# Altium schematic sheet EtherWiz_FullSize.SchDoc
size A3; SheetNumber: 3; SheetTotal: 3
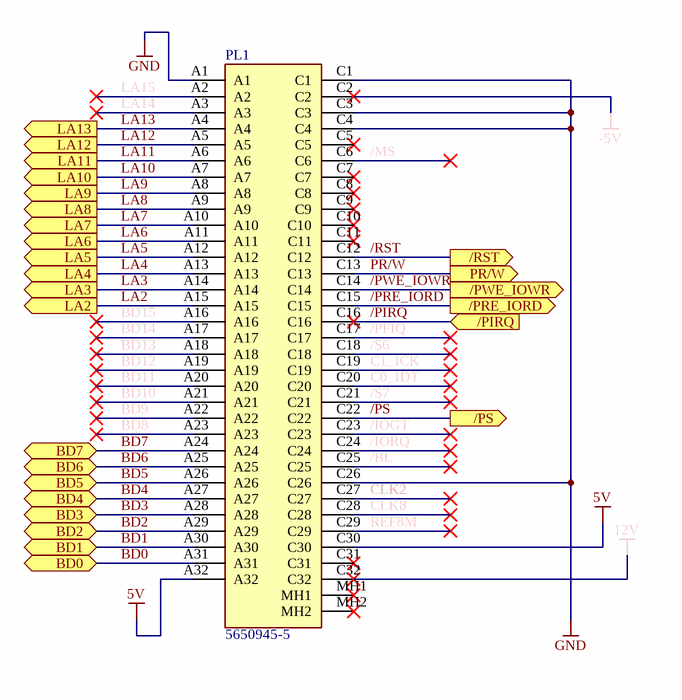
[diagram p0: EtherWiz_FullSize.SchDoc]

## Parts
PL1  5650945-5  [56509455]

## Ports
/PIRQ (in, see EtherWiz[3D]), /PRE_IORD (out, see EtherWiz[6A]), /PS (out, see EtherWiz[6A]), /PWE_IOWR (out, see EtherWiz[6A]), /RST (out, see EtherWiz[2B]), BD0 (bidir, see EtherWiz[5B]), BD1 (bidir, see EtherWiz[5A]), BD2 (bidir, see EtherWiz[5A]), BD3 (bidir, see EtherWiz[5A]), BD4 (bidir, see EtherWiz[5A]), BD5 (bidir, see EtherWiz[5A]), BD6 (bidir, see EtherWiz[5A]), BD7 (bidir, see EtherWiz[5A]), LA2 (out, see EtherWiz[6A]), LA3 (out, see EtherWiz[6A]), LA4 (out, see EtherWiz[2B]), LA5 (out, see EtherWiz[2B]), LA6 (out, see EtherWiz[1B]), LA7 (out, see EtherWiz[1B]), LA8 (out, see EtherWiz[1B]), LA9 (out, see EtherWiz[1B]), LA10 (out, see EtherWiz[1A]), LA11 (out, see EtherWiz[1A]), LA12 (out, see EtherWiz[6A]), LA13 (out, see EtherWiz[6A]), PR/W (out, see EtherWiz[6A])

## Nets
5V: PL1.A32 PL1.C30
12V: PL1.C32
-5V: PL1.C2
GND: PL1.A1 PL1.C1 PL1.C3 PL1.C4 PL1.C26
/BL: PL1.C25
/IOGT: PL1.C23
/IORQ: PL1.C24
/MS: PL1.C6
/PFIQ: PL1.C17
/PIRQ: PL1.C16 ; port /PIRQ
/PRE_IORD: PL1.C15 ; port /PRE_IORD
/PS: PL1.C22 ; port /PS
/PWE_IOWR: PL1.C14 ; port /PWE_IOWR
/RST: PL1.C12 ; port /RST
/S6: PL1.C18
/S7: PL1.C21
BD0: PL1.A31 ; port BD0
BD1: PL1.A30 ; port BD1
BD2: PL1.A29 ; port BD2
BD3: PL1.A28 ; port BD3
BD4: PL1.A27 ; port BD4
BD5: PL1.A26 ; port BD5
BD6: PL1.A25 ; port BD6
BD7: PL1.A24 ; port BD7
BD8: PL1.A23
BD9: PL1.A22
BD10: PL1.A21
BD11: PL1.A20
BD12: PL1.A19
BD13: PL1.A18
BD14: PL1.A17
BD15: PL1.A16
C0_IDT: PL1.C20
C1_ICK: PL1.C19
CLK2: PL1.C27
CLK8: PL1.C28
LA2: PL1.A15 ; port LA2
LA3: PL1.A14 ; port LA3
LA4: PL1.A13 ; port LA4
LA5: PL1.A12 ; port LA5
LA6: PL1.A11 ; port LA6
LA7: PL1.A10 ; port LA7
LA8: PL1.A9 ; port LA8
LA9: PL1.A8 ; port LA9
LA10: PL1.A7 ; port LA10
LA11: PL1.A6 ; port LA11
LA12: PL1.A5 ; port LA12
LA13: PL1.A4 ; port LA13
LA14: PL1.A3
LA15: PL1.A2
PR/W: PL1.C13 ; port PR/W
REF8M: PL1.C29

Not connected (* = marked no-connect by the designer): PL1 C5* C7* C8* C9* C10* C11* C31* MH1* MH2*

## Notes on the sheet
- SIZE
- DIMENSIONS
- TITLE
- VARIANT
- REVISION
- DATE
- A3
- SHEET
- OF
- FILE
- DRAWN BY

## Library data of the parts
PL1 = 5650945-5: Connector; Manufacturer_Name: TE Connectivity; Datasheet Link: https://www.te.com/commerce/DocumentDelivery/DDEController?Action=showdoc&DocId=Customer+Drawing%7F650473%7FS%7Fpdf%7FEnglish%7FENG_CD_650473_S_baseFilename.pdf%7F5650945-5; Height: 11.1mm; Manufacturer_Part_Number: 5650945-5; Mouser Part Number: 571-5650945-5; Mouser Price/Stock: https://www.mouser.co.uk/ProductDetail/TE-Connectivity/5650945-5?qs=%2FFe7VTH785B%252B77b5t925bQ%3D%3D; Arrow Part Number: 5650945-5; Arrow Price/Stock: https://www.arrow.com/en/products/5650945-5/te-connectivity